# Altium schematic sheet Probando_libreriaCreada.SchDoc
size A4
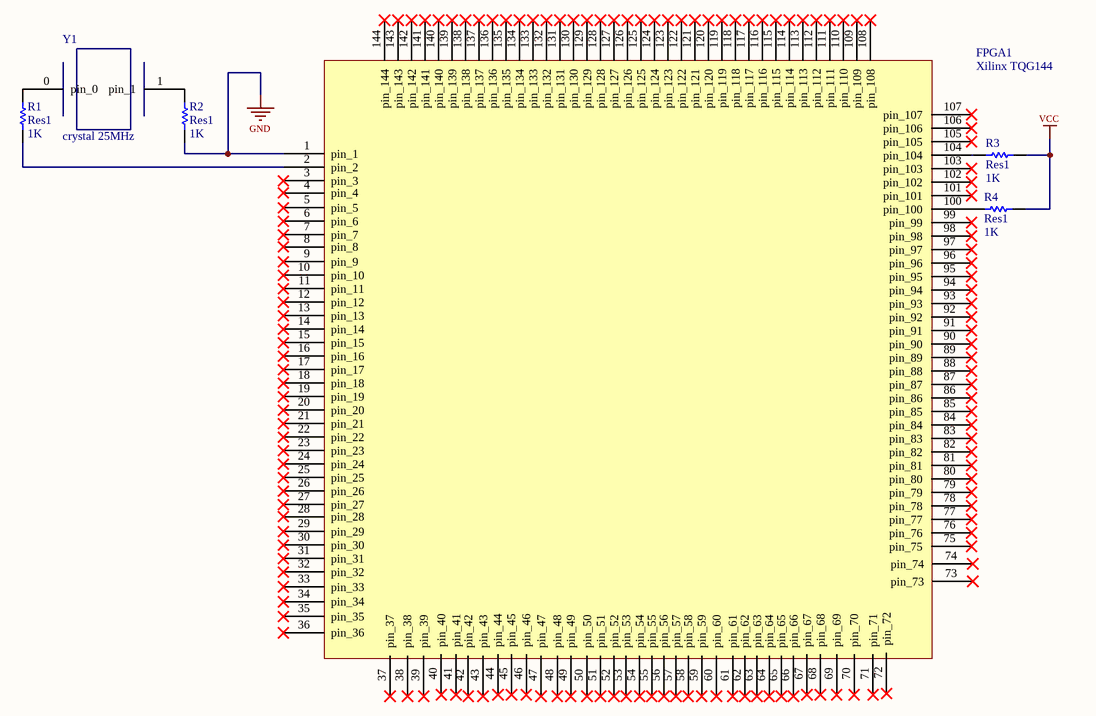
[diagram p0: Probando_libreriaCreada.SchDoc]

## Parts
FPGA1  Xilinx TQG144  [TSQFP50P2200X2200X160-144N_v2]
R1  Res1  value 1K  [AXIAL-0.3]
R2  Res1  value 1K  [AXIAL-0.3]
R3  Res1  value 1K  [AXIAL-0.3]
R4  Res1  value 1K  [AXIAL-0.3]
Y1  crystal 25MHz  [xtal]

## Nets
GND: FPGA1.1(pin_1) R2.1
VCC: R3.2 R4.2
NetFPGA1_2: FPGA1.2(pin_2) R1.1
NetFPGA1_100: FPGA1.100(pin_100) R4.1
NetFPGA1_104: FPGA1.104(pin_104) R3.1
NetR1_2: R1.2 Y1.0(pin_0)
NetR2_2: R2.2 Y1.1(pin_1)

Not connected (* = marked no-connect by the designer): FPGA1 3(pin_3)* 4(pin_4)* 5(pin_5)* 6(pin_6)* 7(pin_7)* 8(pin_8)* 9(pin_9)* 10(pin_10)* 11(pin_11)* 12(pin_12)* 13(pin_13)* 14(pin_14)* 15(pin_15)* 16(pin_16)* 17(pin_17)* 18(pin_18)* 19(pin_19)* 20(pin_20)* 21(pin_21)* 22(pin_22)* 23(pin_23)* 24(pin_24)* 25(pin_25)* 26(pin_26)* 27(pin_27)* 28(pin_28)* 29(pin_29)* 30(pin_30)* 31(pin_31)* 32(pin_32)* 33(pin_33)* 34(pin_34)* 35(pin_35)* 36(pin_36)* 37(pin_37)* 38(pin_38)* 39(pin_39)* 40(pin_40)* 41(pin_41)* 42(pin_42)* 43(pin_43)* 44(pin_44)* 45(pin_45)* 46(pin_46)* 47(pin_47)* 48(pin_48)* 49(pin_49)* 50(pin_50)* 51(pin_51)* 52(pin_52)* 53(pin_53)* 54(pin_54)* 55(pin_55)* 56(pin_56)* 57(pin_57)* 58(pin_58)* 59(pin_59)* 60(pin_60)* 61(pin_61)* 62(pin_62)* 63(pin_63)* 64(pin_64)* 65(pin_65)* 66(pin_66)* 67(pin_67)* 68(pin_68)* 69(pin_69)* 70(pin_70)* 71(pin_71)* 72(pin_72)* 73(pin_73)* 74(pin_74)* 75(pin_75)* 76(pin_76)* 77(pin_77)* 78(pin_78)* 79(pin_79)* 80(pin_80)* 81(pin_81)* 82(pin_82)* 83(pin_83)* 84(pin_84)* 85(pin_85)* 86(pin_86)* 87(pin_87)* 88(pin_88)* 89(pin_89)* 90(pin_90)* 91(pin_91)* 92(pin_92)* 93(pin_93)* 94(pin_94)* 95(pin_95)* 96(pin_96)* 97(pin_97)* 98(pin_98)* 99(pin_99)* 101(pin_101)* 102(pin_102)* 103(pin_103)* 105(pin_105)* 106(pin_106)* 107(pin_107)* 108(pin_108)* 109(pin_109)* 110(pin_110)* 111(pin_111)* 112(pin_112)* 113(pin_113)* 114(pin_114)* 115(pin_115)* 116(pin_116)* 117(pin_117)* 118(pin_118)* 119(pin_119)* 120(pin_120)* 121(pin_121)* 122(pin_122)* 123(pin_123)* 124(pin_124)* 125(pin_125)* 126(pin_126)* 127(pin_127)* 128(pin_128)* 129(pin_129)* 130(pin_130)* 131(pin_131)* 132(pin_132)* 133(pin_133)* 134(pin_134)* 135(pin_135)* 136(pin_136)* 137(pin_137)* 138(pin_138)* 139(pin_139)* 140(pin_140)* 141(pin_141)* 142(pin_142)* 143(pin_143)* 144(pin_144)*

## Library data of the parts
R1-R4 = Res1: Resistor; Published: 8-Jun-2000; LatestRevisionDate: 17-Jul-2002; LatestRevisionNote: Re-released for DXP Platform.; PackageReference: AXIAL-0.3; Publisher: Altium Limited; PackageDescription: Axial Device, Thru-Hole; 2 Leads; 0.3 in Pin Spacing
Y1 = CRY: Surface Mount Crystal; pin to pad: 0>a0 1>a1